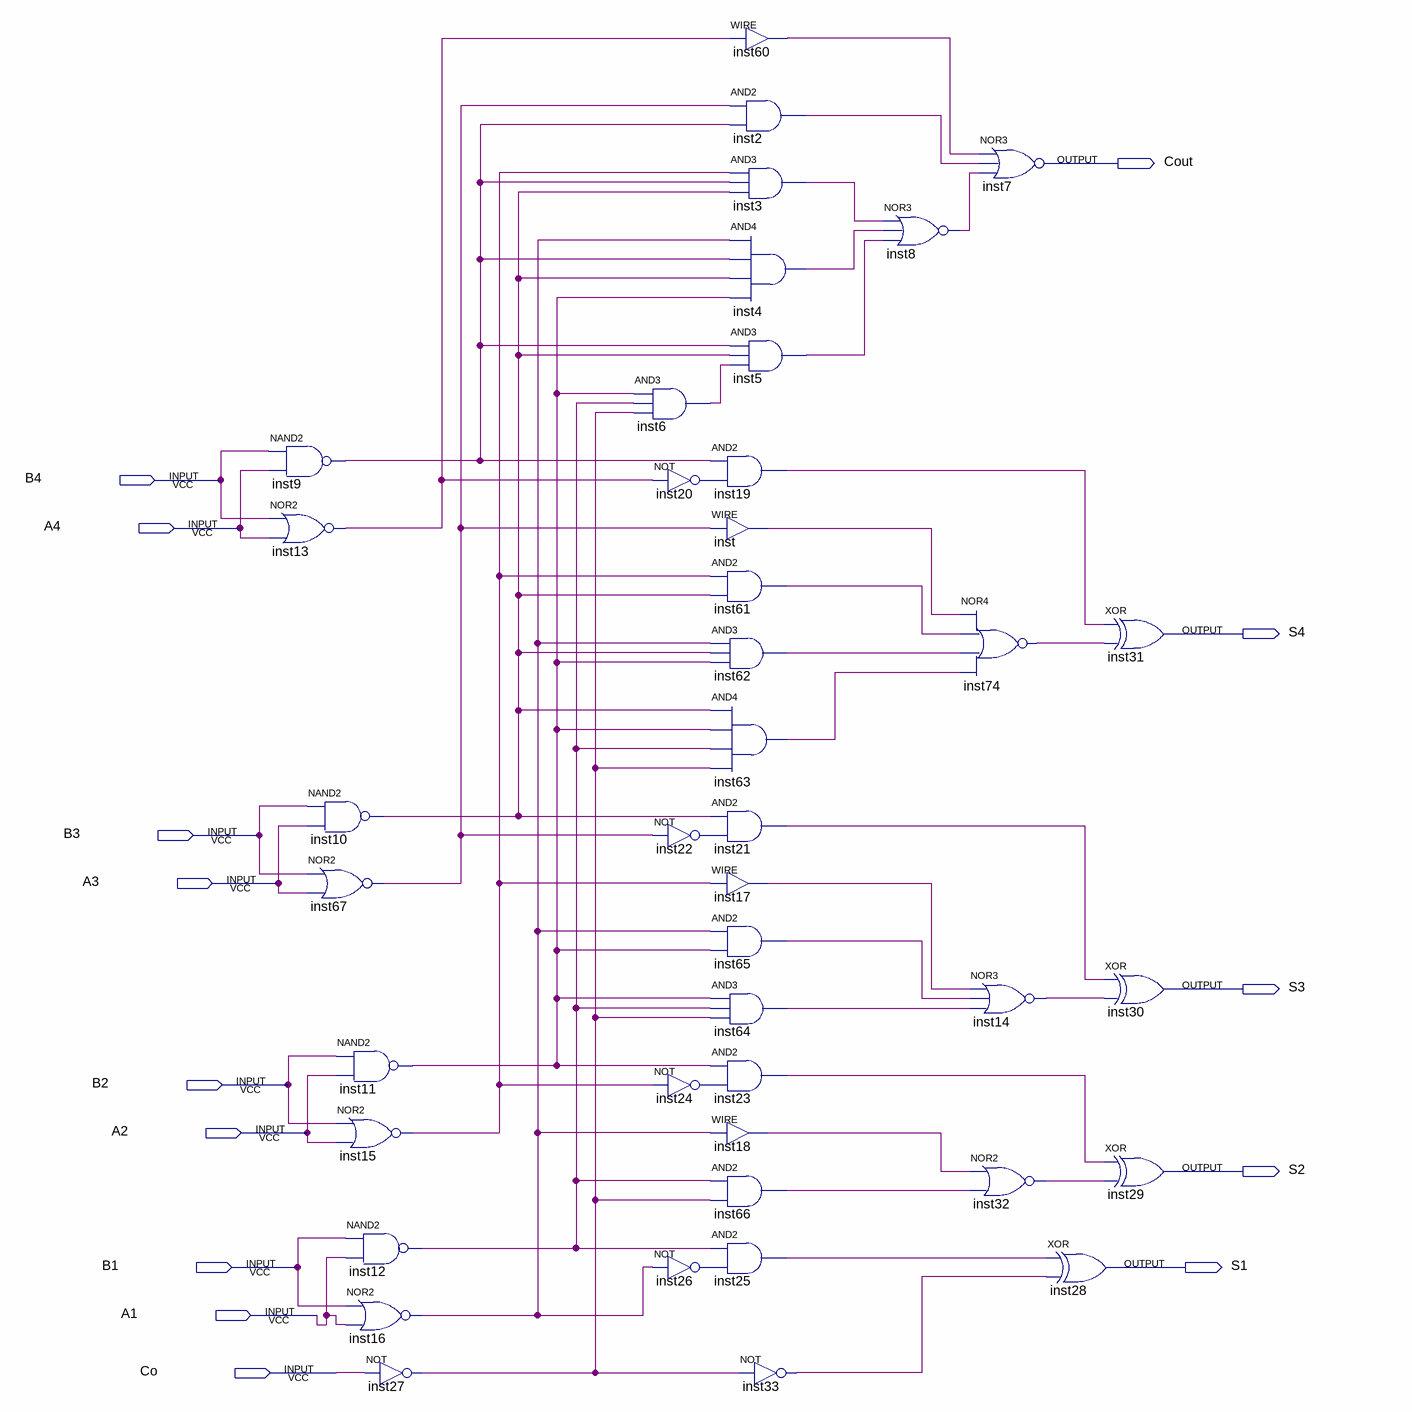
[diagram p0: schematic sheet]
// Quartus schematic Ci_somador.bdf as structural Verilog: 42 symbols, 14 pins
module Ci_somador (
  input  B4,
  input  A4,
  input  B3,
  input  A3,
  input  B2,
  input  A2,
  input  B1,
  input  A1,
  input  Co,
  output Cout,
  output S4,
  output S3,
  output S2,
  output S1
);

  wire inst2_out, inst3_out, inst4_out, inst5_out, inst6_out, inst8_out, inst9_out, inst10_out, inst11_out,
       inst12_out, inst13_out, inst14_out, inst15_out, inst16_out, inst17_out, inst18_out, inst19_out,
       inst20_out, inst21_out, inst22_out, inst23_out, inst24_out, inst25_out, inst26_out, inst27_out,
       inst32_out, inst33_out, inst60_out, inst61_out, inst62_out, inst63_out, inst64_out, inst65_out,
       inst66_out, inst67_out, inst74_out, inst_out;

  nand inst9 (inst9_out, B4, A4);
  nor inst13 (inst13_out, B4, A4);
  nand inst10 (inst10_out, B3, A3);
  nor inst67 (inst67_out, B3, A3);
  nand inst11 (inst11_out, B2, A2);
  nor inst15 (inst15_out, B2, A2);
  nand inst12 (inst12_out, B1, A1);
  nor inst16 (inst16_out, B1, A1);
  not inst27 (inst27_out, Co);
  and inst6 (inst6_out, inst11_out, inst12_out, inst27_out);
  and inst19 (inst19_out, inst9_out, inst20_out);
  not inst20 (inst20_out, inst13_out);
  assign inst_out = inst67_out;  // WIRE inst
  and inst61 (inst61_out, inst15_out, inst10_out);
  and inst62 (inst62_out, inst16_out, inst10_out, inst11_out);
  and inst63 (inst63_out, inst10_out, inst11_out, inst12_out, inst27_out);
  and inst21 (inst21_out, inst10_out, inst22_out);
  not inst22 (inst22_out, inst67_out);
  assign inst17_out = inst15_out;  // WIRE inst17
  and inst65 (inst65_out, inst16_out, inst11_out);
  and inst64 (inst64_out, inst11_out, inst12_out, inst27_out);
  and inst23 (inst23_out, inst11_out, inst24_out);
  not inst24 (inst24_out, inst15_out);
  assign inst18_out = inst16_out;  // WIRE inst18
  and inst66 (inst66_out, inst12_out, inst27_out);
  and inst25 (inst25_out, inst12_out, inst26_out);
  not inst26 (inst26_out, inst16_out);
  assign inst60_out = inst13_out;  // WIRE inst60
  and inst2 (inst2_out, inst67_out, inst9_out);
  and inst3 (inst3_out, inst15_out, inst9_out, inst10_out);
  and inst4 (inst4_out, inst16_out, inst9_out, inst10_out, inst11_out);
  and inst5 (inst5_out, inst9_out, inst10_out, inst6_out);
  not inst33 (inst33_out, inst27_out);
  nor inst8 (inst8_out, inst3_out, inst4_out, inst5_out);
  nor inst7 (Cout, inst60_out, inst2_out, inst8_out);
  nor inst74 (inst74_out, inst_out, inst61_out, inst62_out, inst63_out);
  nor inst14 (inst14_out, inst17_out, inst65_out, inst64_out);
  nor inst32 (inst32_out, inst18_out, inst66_out);
  xor inst31 (S4, inst19_out, inst74_out);
  xor inst30 (S3, inst21_out, inst14_out);
  xor inst29 (S2, inst23_out, inst32_out);
  xor inst28 (S1, inst25_out, inst33_out);
endmodule
